# EAGLE design adsb_2b (EAGLE 4.15)
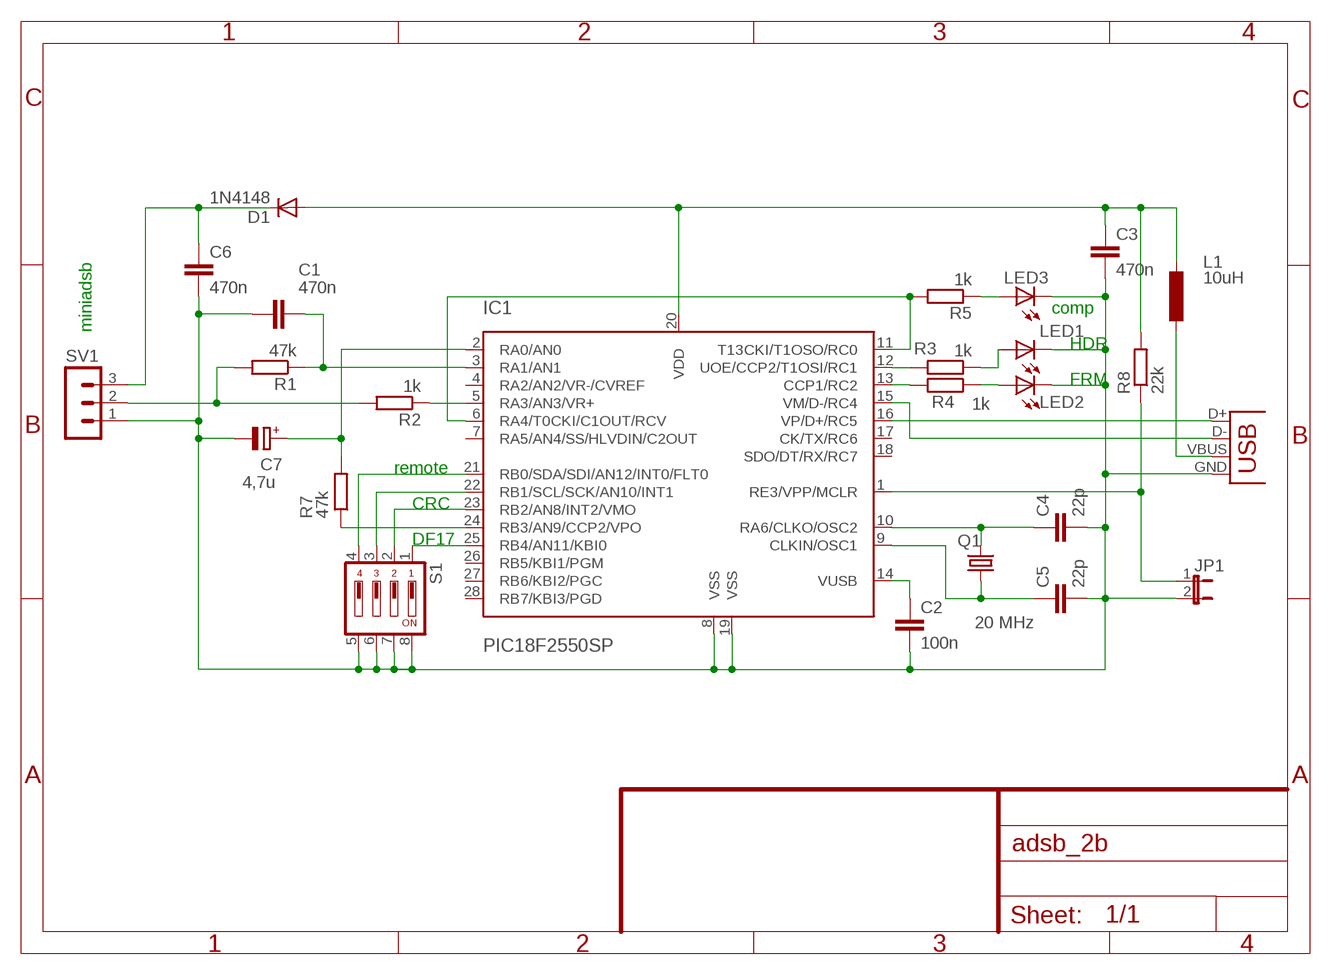
[diagram p0: schematic, sheet 1]

## Parts
C1  470n  C-EU025-025X050  [C025-025X050]
C2  100n  C-EU025-025X050  [C025-025X050]
C3  470n  C-EU025-025X050  [C025-025X050]
C4  22p  C-EU025-025X050  [C025-025X050]
C5  22p  C-EU025-025X050  [C025-025X050]
C6  470n  C-EU025-025X050  [C025-025X050]
C7  4,7u  CPOL-EUE2,5-6E  [E2,5-6E]
D1  1N4148  [DO35-10]
IC1  PIC18F2550SP  [DIL28-3]
JP1  JP1E  [JP1]
L1  10uH  L-EU0207/10  [0207/10]
LED1  LED3MM  [LED3MM]
LED2  LED3MM  [LED3MM]
LED3  LED3MM  [LED3MM]
Q1  20 MHz  CRYTALHC49U-V  [HC49U-V]
R1  47k  R-EU_0207/10  [0207/10]
R2  1k  R-EU_0207/10  [0207/10]
R3  1k  R-EU_0207/10  [0207/10]
R4  1k  R-EU_0207/10  [0207/10]
R5  1k  R-EU_0207/10  [0207/10]
R7  47k  R-EU_0207/10  [0207/10]
R8  22k  R-EU_0207/10  [0207/10]
S1  DS04  [DS-04]
SV1  MA03-1  [MA03-1]
X1  USB-B-H  [USB-B-H]

## Nets
N$1: IC1.23(RB2/AN8/INT2/VMO) S1.2
N$2: LED3.A R5.1
N$3: L1.1 X1.VBUS
N$4: C7.+ IC1.2(RA0/AN0) R7.2
N$5: IC1.16(VP/D+/RC5) X1.D+
N$6: IC1.15(VM/D-/RC4) X1.D-
N$7: IC1.6(RA4/T0CKI/C1OUT/RCV) IC1.11(T13CKI/T1OSO/RC0) R5.2
N$8: IC1.24(RB3/AN9/CCP2/VPO) R7.1
N$9: IC1.5(RA3/AN3/VR+) R2.1
N$10: C1.1 IC1.3(RA1/AN1) R1.1
N$11: C5.1 IC1.9(CLKIN/OSC1) Q1.1
N$12: C4.1 IC1.10(RA6/CLKO/OSC2) Q1.2
N$13: IC1.25(RB4/AN11/KBI0) S1.1
N$14: R1.2 R2.2 SV1.2
N$15: C6.1 D1.C SV1.3
N$16: IC1.21(RB0/SDA/SDI/AN12/INT0/FLT0) S1.4
N$17: IC1.12(UOE/CCP2/T1OSI/RC1) R3.2
N$18: IC1.13(CCP1/RC2) R4.2
N$19: LED1.A R3.1
N$20: LED2.A R4.1
N$21: IC1.22(RB1/SCL/SCK/AN10/INT1) S1.3
N$22: IC1.1(RE3/VPP/MCLR) JP1.1 R8.1
VDD: C3.1 D1.A IC1.20(VDD) L1.2 R8.2
VSS: C1.2 C2.2 C3.2 C4.2 C5.2 C6.2 C7.- IC1.8(VSS) IC1.19(VSS) JP1.2 LED1.K(C) LED2.K(C) LED3.K(C) S1.5 S1.6 S1.7 S1.8 SV1.1 X1.GND
VUSB: C2.1 IC1.14(VUSB)
Unconnected: IC1.4(RA2/AN2/VR-/CVREF) IC1.7(RA5/AN4/SS/HLVDIN/C2OUT) IC1.17(CK/TX/RC6) IC1.18(SDO/DT/RX/RC7) IC1.26(RB5/KBI1/PGM) IC1.27(RB6/KBI2/PGC) IC1.28(RB7/KBI3/PGD)

## Notes on the sheet
- comp
- miniadsb
- HDR
- FRM
- remote
- CRC
- DF17

## Library data of the parts
C1-C6 = rcl:C-EU: CAPACITOR, European symbol
C7 = rcl:CPOL-EU: POLARIZED CAPACITOR, European symbol
D1 = diode:1N4148: DIODE high speed (Philips)
IC1 = microchip-dspic:PIC18F2550: PIC18F Flash Microcontroller with USB port
JP1 = jumper:JP1E: JUMPER
L1 = rcl:L-EU: INDUCTOR, European symbol
LED1-LED3 = led:LED: LED OSRAM: - CHIPLED LG R971, LG N971, LY N971, LG Q971, LY Q971, LO R971, LY R971 LH N974, LH R974 LS Q976, LO Q976, LY Q976 LO Q996 - Hyper CHIPLED LW Q18S LB Q993, LB Q99A, LB R99A - SideLED LS A670, LO A670, LY A670, LG A670, LP A670 LB A673, LV A673, LT A673, LW A673 LH A674 LY A675 LS A676, LA A676, LO A676, LY A676, LW A676 LS A679, LY A679, LG A679 - Hyper Micro SIDELED® LS Y876, LA Y876, LO Y876, LY Y876 LT Y87S - SmartLED LW L88C, LW L88S LB L89C, LB L89S, LG L890 LS L89K, LO L89K, LY L89K LS L896, LA L896, LO L896, LY L896 - TOPLED LS T670, LO T670, LY T670, LG T670, LP T670 LSG T670, LSP T670, LSY T670, LOP T670, LYG T670 LG T671, LOG T671, LSG T671 LB T673, LV T673, LT T673, LW T673 LH T674 LS T676, LA T676, LO T676, LY T676, LB T676, LH T676, LSB T676, LW T676 LB T67C, LV T67C, LT T67C, LS T67K, LO T67K, LY T67K, LW E67C LS E67B, LA E67B, LO E67B, LY E67B, LB E67C, LV E67C, LT E67C LW T67C LS T679, LY T679, LG T679 LS T770, LO T770, LY T770, LG T770, LP T770 LB T773, LV T773, LT T773, LW T773 LH T774 LS E675, LA E675, LY E675, LS T675 LS T776, LA T776, LO T776, LY T776, LB T776 LHGB T686 LT T68C, LB T68C - Hyper Mini TOPLED® LB M676 - Mini TOPLED Santana® LG M470 LS M47K, LO M47K, LY M47K Source: http://www.osram.convergy.de/
Q1 = crystal:CRYTAL: CRYSTAL
R1-R5 R7 R8 = rcl:R-EU_: RESISTOR, European symbol
S1 = switch-dil:DS04: DIL/CODE SWITCH
SV1 = con-lstb:MA03-1: PIN HEADER
X1 = con-usb:USB: USB Connectors

## Board
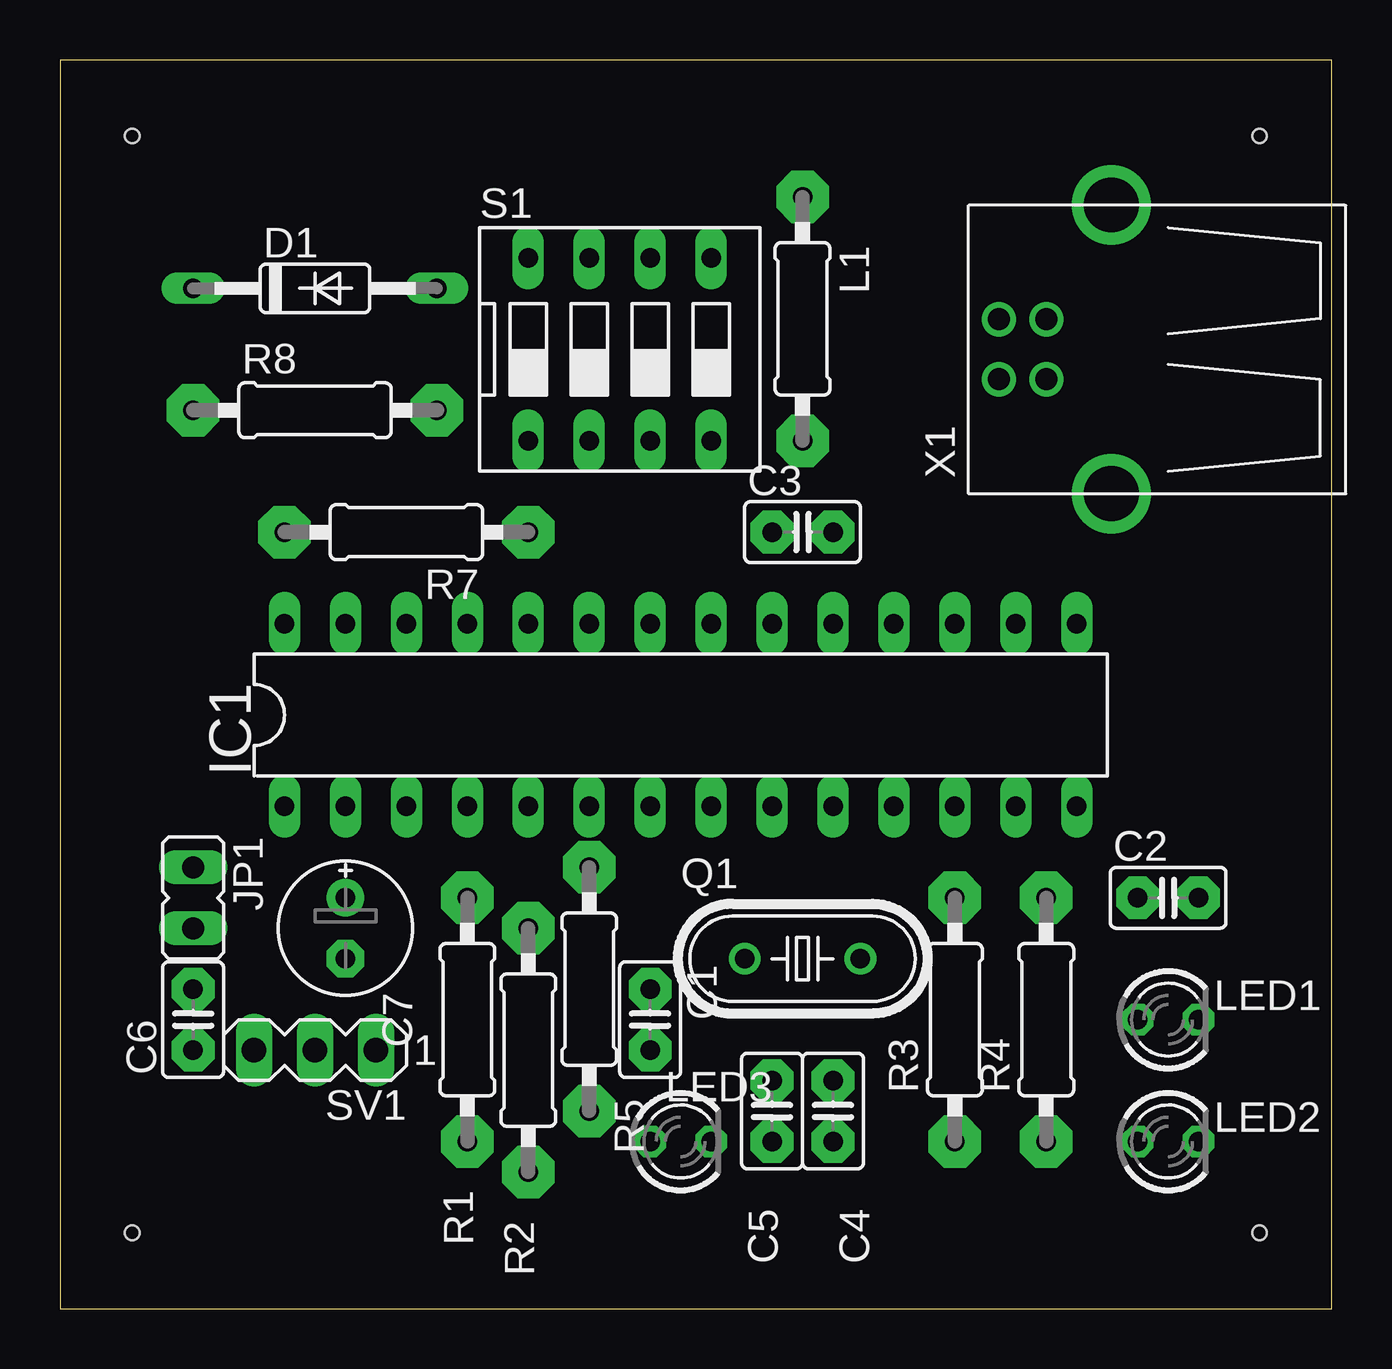
[diagram p1: board, top side]
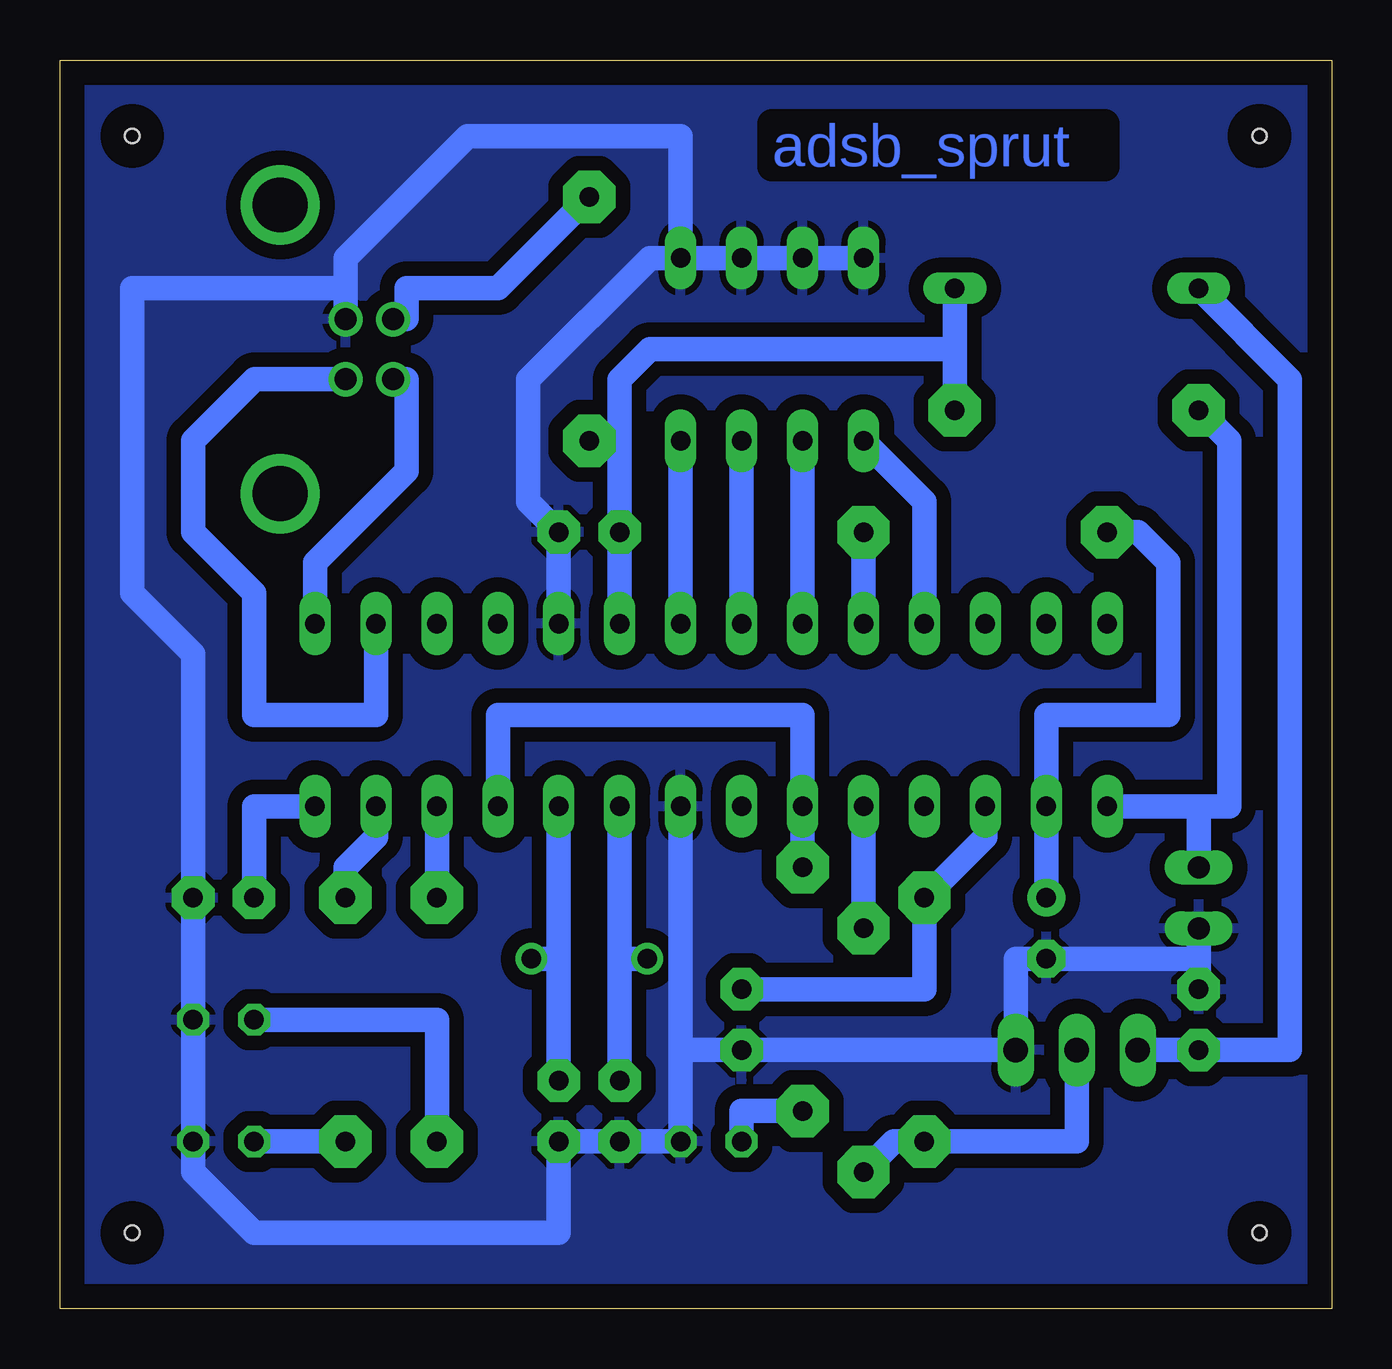
[diagram p2: board, bottom side, seen from below]

Size 53.01 x 52.06 mm. Coordinates in mm from the lower left corner, seen from the top.
Outline: 0,0 53.01,0 53.01,52.06 0,52.06 0,0
Copper layers (1*16): Top 0.035mm / dielectric 1.5mm / Bottom 0.035mm
Design rules "default": minimum track width 10mil, minimum drill 24mil, track to track 8mil, track to pad 8mil, pad to pad 8mil, via to via 8mil, smd to smd 8mil, copper to edge 40mil, drill to drill 8mil, minimum pad ring 10mil, minimum via ring 8mil, stop-mask expansion 4mil, vias tented up to drill 0mil, thermal gap 10mil
Holes 0.6 mm at 3.01,48.89 50,48.89 3.01,3.17 50,3.17

### Footprints (pad centres in the part's own frame; a part is rotated, then mirrored left to right if it is on the bottom)
C025-025X050 = drill 0.813 pad 1.778 octagon: 1 -1.27,0; 2 1.27,0
E2,5-6E = drill 0.813 pad 1.575 round: + -1.27,0 | drill 0.813 pad 1.575 octagon: - 1.27,0
DO35-10 = drill 0.813 long: A 5.08,0; C -5.08,0
DIL28-3 = drill 0.813 long: 1 -16.51,-3.81; 2 -13.97,-3.81; 3 -11.43,-3.81; 4 -8.89,-3.81; 5 -6.35,-3.81; 6 -3.81,-3.81; 7 -1.27,-3.81; 8 1.27,-3.81; 9 3.81,-3.81; 10 6.35,-3.81; 11 8.89,-3.81; 12 11.43,-3.81; 13 13.97,-3.81; 14 16.51,-3.81; 15 16.51,3.81; 16 13.97,3.81; 17 11.43,3.81; 18 8.89,3.81; 19 6.35,3.81; 20 3.81,3.81; 21 1.27,3.81; 22 -1.27,3.81; 23 -3.81,3.81; 24 -6.35,3.81; 25 -8.89,3.81; 26 -11.43,3.81; 27 -13.97,3.81; 28 -16.51,3.81
JP1 = drill 0.914 long: 1 0,-1.27; 2 0,1.27
0207/10 = drill 0.813 pad 2.184 octagon: 1 -5.08,0; 2 5.08,0
LED3MM = drill 0.813 octagon: A -1.27,0; K 1.27,0
HC49U-V = drill 0.813 round: 1 -2.413,0; 2 2.413,0
DS-04 = drill 0.813 long: 1 -3.81,-3.81; 2 -1.27,-3.81; 3 1.27,-3.81; 4 3.81,-3.81; 5 3.81,3.81; 6 1.27,3.81; 7 -1.27,3.81; 8 -3.81,3.81
MA03-1 = drill 1.016 long: 1 -2.54,0; 2 0,0; 3 2.54,0
USB-B-H = drill 0.914 round: D+ 0,1.25; D- 1.981,1.25; GND 0,-1.25; VBUS 1.981,-1.25 | drill 2.286 round: SCH1 -2.718,6.02; SCH2 -2.718,-6.02

### Placement (x,y rotation side)
C1  24.6,12.06 270 top
C2  46.19,17.14 0 top
C3  30.95,32.38 0 top
C4  32.22,8.25 270 top
C5  29.68,8.25 270 top
C6  5.55,12.06 90 top
C7  11.9,15.87 270 top
D1  10.63,42.54 0 top
IC1  25.87,24.76 0 top
JP1  5.55,17.14 180 top
L1  30.95,41.27 270 top
LED1  46.19,12.06 0 top
LED2  46.19,6.98 0 top
LED3  25.87,6.98 0 top
Q1  30.95,14.6 0 top
R1  16.98,12.06 270 top
R2  19.52,10.79 270 top
R3  37.3,12.06 90 top
R4  41.11,12.06 90 top
R5  22.06,13.33 90 top
R7  14.44,32.38 180 top
R8  10.63,37.46 0 top
S1  23.33,40 0 top
SV1  10.63,10.79 180 top
X1  41.11,40 180 top

### Tracks (layer width: path | path; a pad name or v marks a point on that pad's centre or on a via)
N$1
  Bottom 1.016: IC1.23 S1.2
N$2
  Bottom 1.016: LED3.A 24.6,8.25 R5.1
N$3
  Bottom 0.406: 38.57,41.27 38.59,41.25
  Bottom 1.016: L1.1 34.76,42.54 38.57,42.54 38.57,41.27 | 38.59,41.25 X1.VBUS
N$4
  Bottom 0.406: C7.+ IC1.2
  Bottom 1.016: C7.+ 11.9,24.76 6.82,24.76 6.82,31.11 8.09,32.38 R7.2
N$5
  Bottom 1.016: X1.D+ 44.9,38.75 47.46,36.19 47.46,32.38 44.92,29.84 44.92,24.76 39.84,24.76 IC1.16
N$6
  Bottom 0.406: 38.57,38.73 38.59,38.75
  Bottom 1.016: IC1.15 42.38,31.11 38.57,34.92 38.57,38.73 | 38.59,38.75 X1.D-
N$7
  Bottom 1.016: IC1.11 34.76,24.76 22.06,24.76 IC1.6 R5.2
N$8
  Bottom 1.016: IC1.24 R7.1
N$9
  Bottom 1.016: R2.1 IC1.5
N$10
  Bottom 1.016: IC1.3 14.44,19.68 R1.1 16.98,13.33 C1.1
N$11
  Bottom 1.016: C5.1 29.68,14.6 | 29.68,14.6 IC1.9 | 29.68,14.6 Q1.1
N$12
  Bottom 1.016: C4.1 32.22,14.6 | 32.22,14.6 IC1.10 | 32.22,14.6 Q1.2
N$13
  Bottom 1.016: IC1.25 16.98,33.65 S1.1
N$14
  Bottom 1.016: R2.2 18.25,6.98 R1.2 10.63,6.98 SV1.2
N$15
  Bottom 1.016: D1.C 1.74,38.73 1.74,10.79 C6.1 SV1.3
N$16
  Bottom 1.016: IC1.21 S1.4
N$17
  Bottom 1.016: R3.2 IC1.12
N$18
  Bottom 1.016: IC1.13 39.84,19.68 41.11,18.41 R4.2
N$19
  Bottom 1.016: R3.1 37.3,12.06 LED1.A
N$20
  Bottom 1.016: R4.1 LED2.A
N$21
  Bottom 1.016: IC1.22 S1.3
N$22
  Bottom 1.016: 5.55,20.95 4.28,20.95 4.28,36.19 R8.1 | 5.55,20.95 IC1.1 | JP1.1 5.55,20.95
VDD
  Bottom 1.016: IC1.20 C3.1 29.68,36.19 | 29.68,36.19 29.68,38.73 28.41,40 15.71,40 | 15.71,40 D1.A | 29.68,36.19 L1.2 | R8.2 15.71,40
VSS
  Bottom 1.016: 41.11,42.54 41.11,43.81 36.03,48.89 27.14,48.89 S1.5 | 41.11,42.54 X1.GND | 47.46,5.71 LED2.K LED1.K C2.2 | C3.2 IC1.19 C3.2 | S1.8 S1.7 S1.6 S1.5 | S1.5 28.41,43.81 33.49,38.73 33.49,33.65 C3.2 | 47.46,5.71 44.92,3.17 32.22,3.17 C4.2 C5.2 LED3.K 27.14,10.79 | 47.46,5.71 C2.2 | C2.2 47.46,27.3 50,29.84 50,42.54 41.11,42.54 | C6.2 JP1.2 5.55,14.6 C7.- 13.17,14.6 SV1.1 C1.2 27.14,10.79 | 27.14,10.79 IC1.8
  pour Bottom (isolate 0.61): 53.81,52.7 53.81,-0.64 -0.8,-0.64 -0.8,52.7
VUSB
  Bottom 1.016: C2.1 44.92,20.95 IC1.14

### Text on the board
Bottom: adsb_sprut